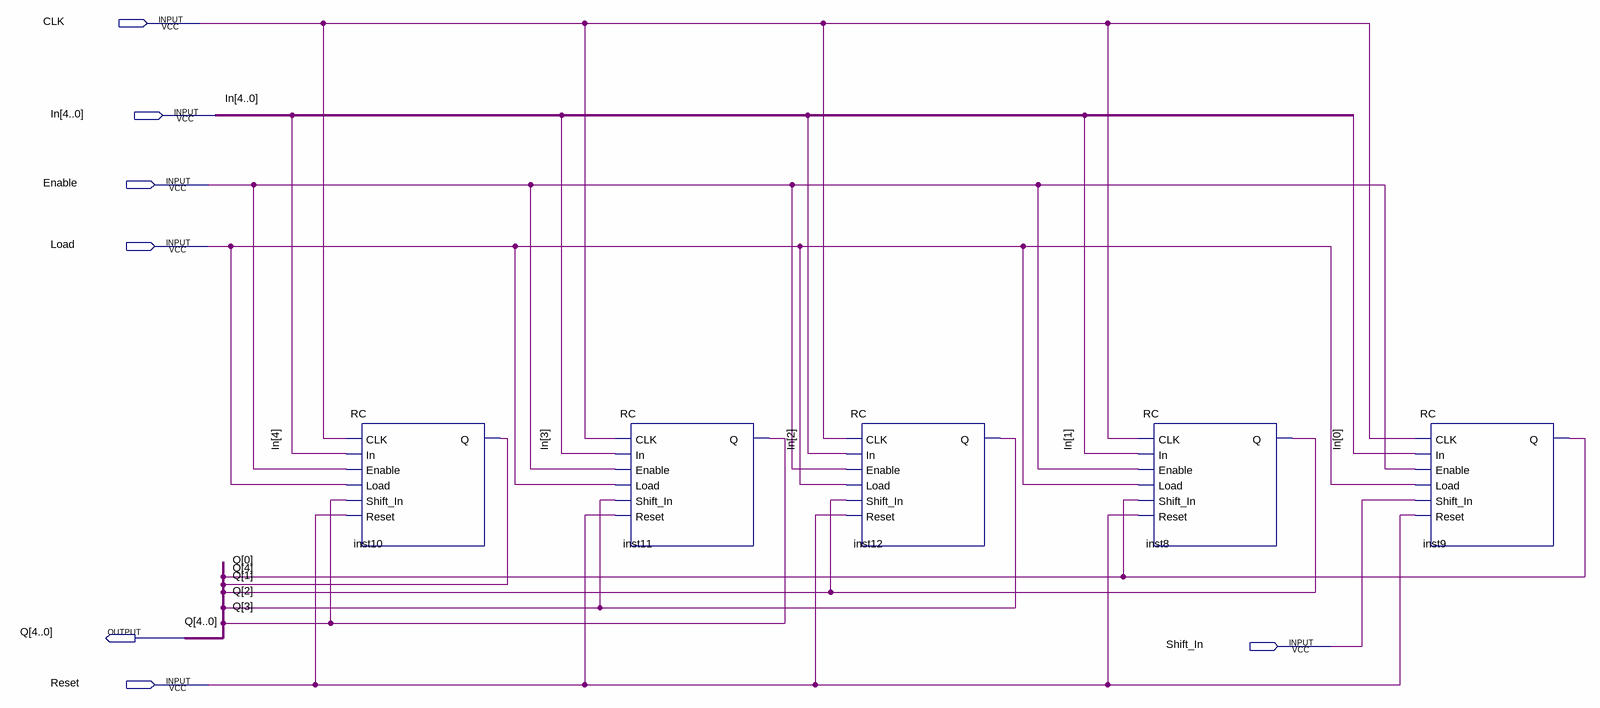
[diagram p0: schematic sheet]
// Quartus schematic ShiftLeftReg_5bit.bdf as structural Verilog: 5 symbols, 7 pins
module ShiftLeftReg_5bit (
  input  CLK,
  input  [4:0] In,
  input  Enable,
  input  Load,
  input  Shift_In,
  input  Reset,
  output [4:0] Q
);

  RC inst10 (.CLK(CLK), .In(In[4]), .Enable(Enable), .Load(Load), .Shift_In(Q[3]), .Reset(Reset), .Q(Q[4]));
  RC inst11 (.CLK(CLK), .In(In[3]), .Enable(Enable), .Load(Load), .Shift_In(Q[2]), .Reset(Reset), .Q(Q[3]));
  RC inst12 (.CLK(CLK), .In(In[2]), .Enable(Enable), .Load(Load), .Shift_In(Q[1]), .Reset(Reset), .Q(Q[2]));
  RC inst8 (.CLK(CLK), .In(In[1]), .Enable(Enable), .Load(Load), .Shift_In(Q[0]), .Reset(Reset), .Q(Q[1]));
  RC inst9 (.CLK(CLK), .In(In[0]), .Enable(Enable), .Load(Load), .Shift_In(Shift_In), .Reset(Reset), .Q(Q[0]));
endmodule
